# Altium schematic sheet SW6208 Demo board.SchDoc
size A2; SheetNumber: 0; SheetTotal: 0
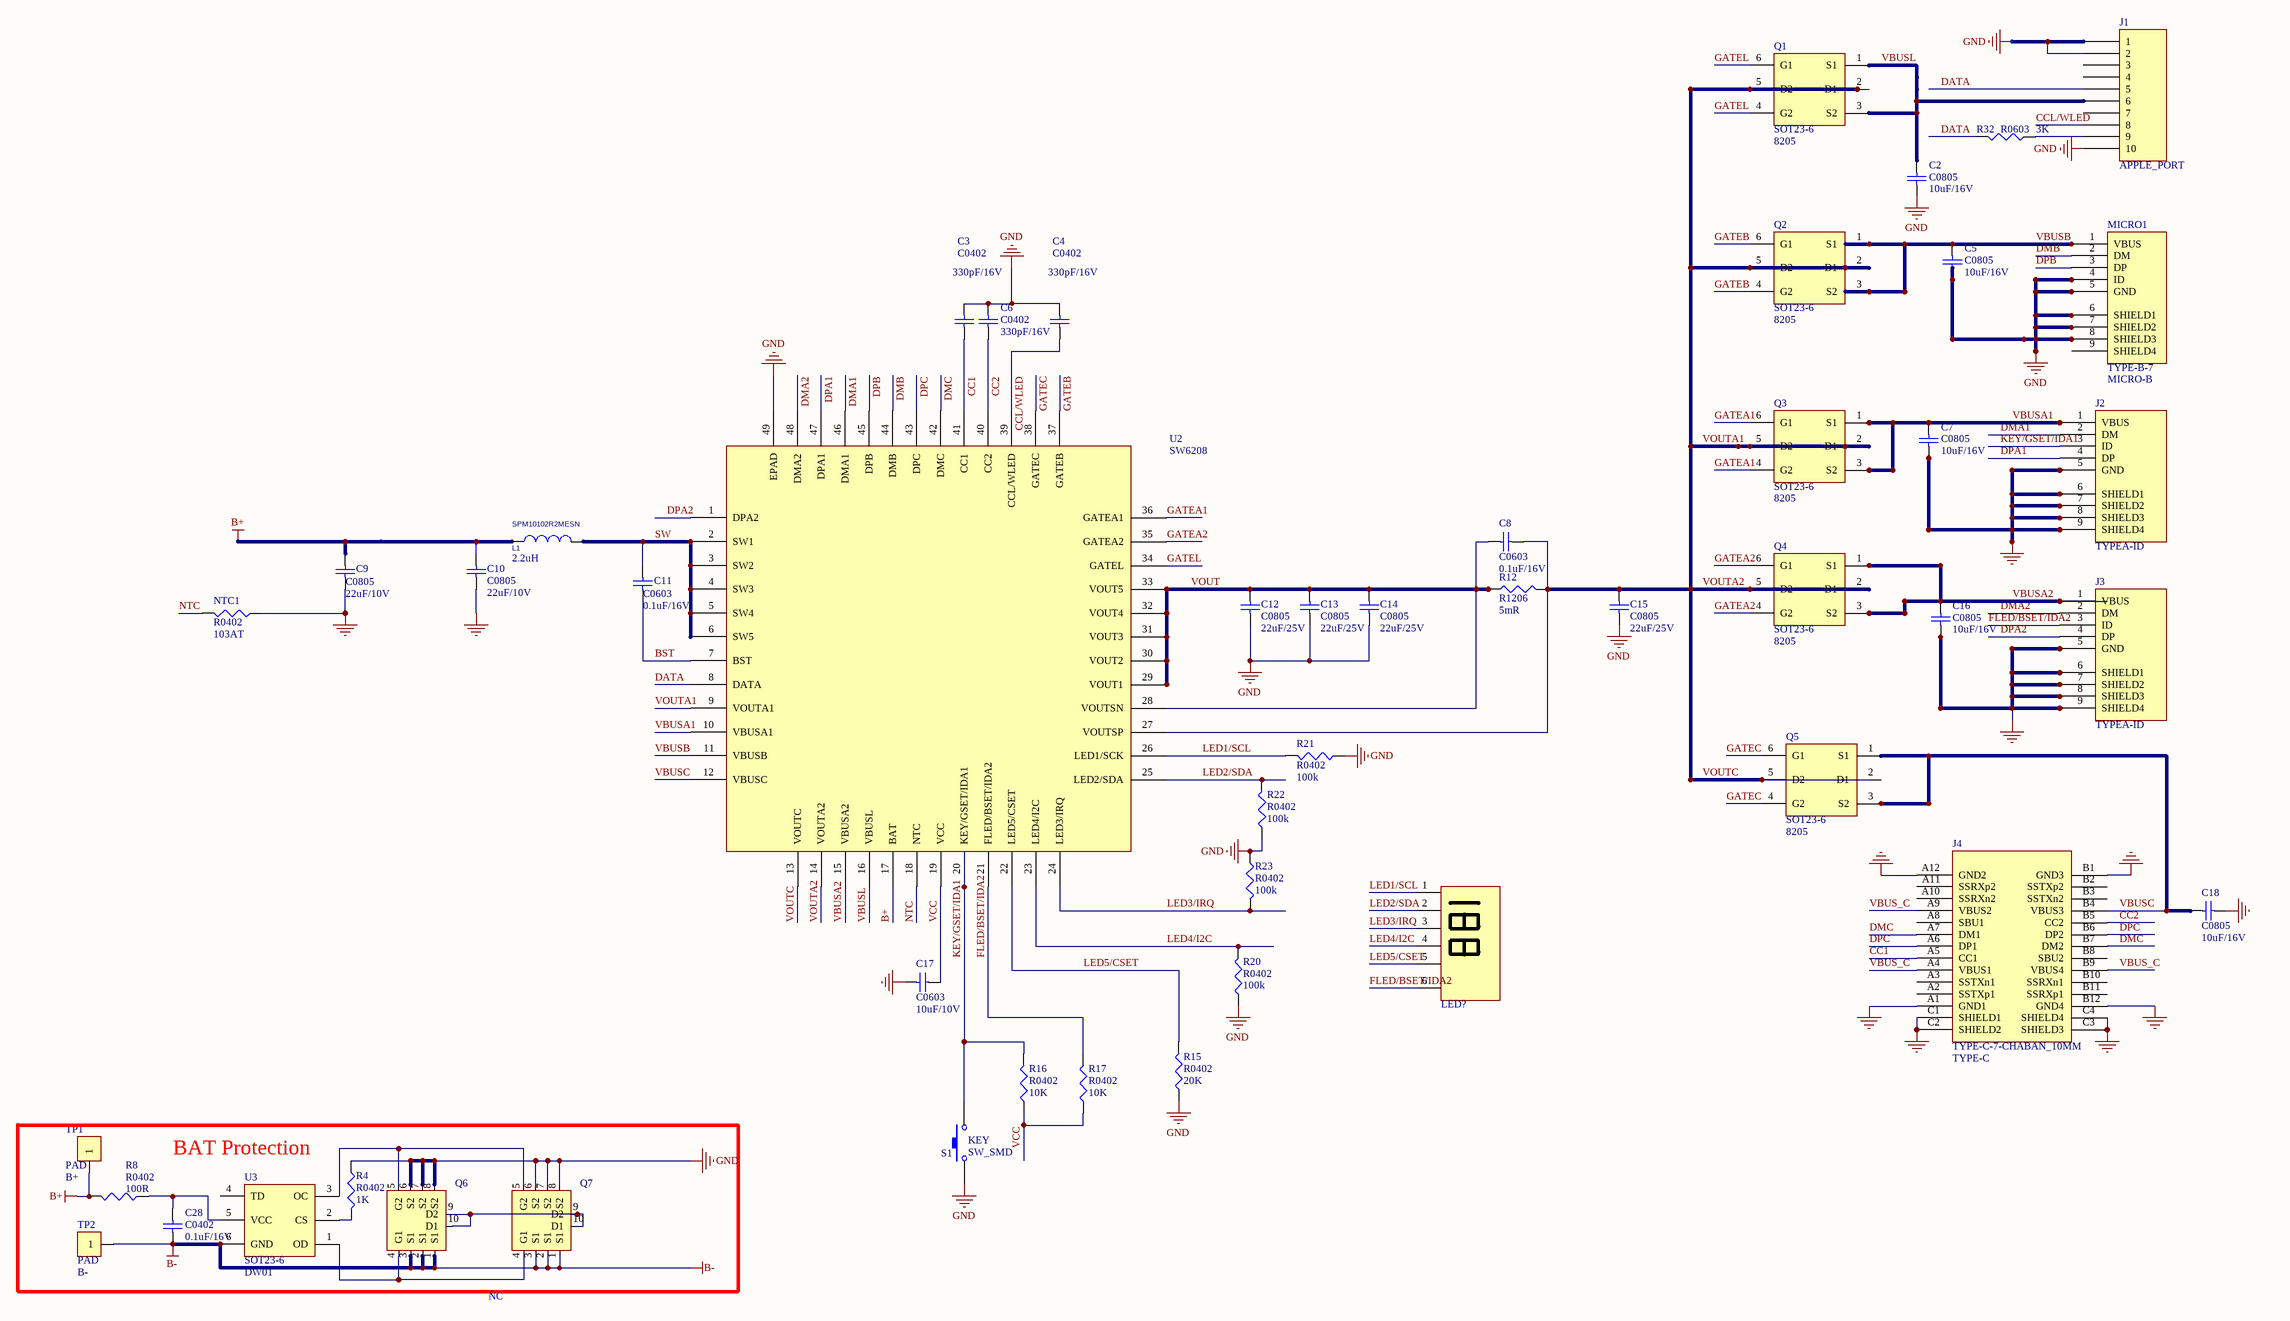
[diagram p0: SW6208 Demo board.SchDoc]

## Parts
C2  C0805  value 10uF/16V  [C0805]
C3  C0402  value 330pF/16V  [c0603]
C4  C0402  value 330pF/16V  [c0603]
C5  C0805  value 10uF/16V  [C0805]
C6  C0402  value 330pF/16V  [c0603]
C7  C0805  value 10uF/16V  [C0805]
C8  C0603  value 0.1uF/16V  [C0603]
C9  C0805  value 22uF/10V  [C0805]
C10  C0805  value 22uF/10V  [C0805]
C11  C0603  value 0.1uF/16V  [C0603]
C12  C0805  value 22uF/25V  [C0805]
C13  C0805  value 22uF/25V  [C0805]
C14  C0805  value 22uF/25V  [C0805]
C15  C0805  value 22uF/25V  [C0805]
C16  C0805  value 10uF/16V  [C0805]
C17  C0603  value 10uF/10V  [c0603]
C18  C0805  value 10uF/16V  [C0805]
C28  C0402  value 0.1uF/16V  [0402C]
J1  APPLE_PORT  [Lightning]
J2  TYPEA-ID  [USB-OPPO-1]
J3  TYPEA-ID  [USB-OPPO-1]
J4  Footprint: TYPE-C-7-CHABAN_10MM  [TYPEC-1]  (hidden comment: TYPE-C)
L1  SPM10102R2MESN  value 2.2uH  [L7*7]
LED?  LED_6  [6-数码管居下]  (value not drawn)
MICRO1  value MICRO-B  Footprintf: TYPE-B-7  [MICRO常规]  (hidden comment: USB_MICRO_B)
NTC1  R0402  value 103AT  [R0402]
Q1  Footprinf: SOT23-6  [SOT-23-6]  (hidden comment: 8205)
Q2  Footprinf: SOT23-6  [SOT-23-6]  (hidden comment: 8205)
Q3  Footprinf: SOT23-6  [SOT-23-6]  (hidden comment: 8205)
Q4  Footprinf: SOT23-6  [SOT-23-6]  (hidden comment: 8205)
Q5  Footprinf: SOT23-6  [SOT-23-6]  (hidden comment: 8205)
Q6  (no value)  [DFN3*3-EPAD - duplicate]
Q7  NC  [DFN3*3-EPAD - duplicate]
R4  R0402  value 1K  [R0402]
R8  R0402  value 100R  [R0402]
R12  R1206  value 5mR  [R1206]
R15  R0402  value 20K  [R0402]
R16  R0402  value 10K  [R0402]
R17  R0402  value 10K  [R0402]
R20  R0402  value 100k  [R0402]
R21  R0402  value 100k  [R0402]
R22  R0402  value 100k  [R0402]
R23  R0402  value 100k  [R0402]
R32  R0603  value 3K  [R0603]
S1  Footprinf: SW_SMD  (hidden comment: KEY)
TP1  Footprint: PAD  [TIP_4*6]  (hidden comment: B+)
TP2  Footprint: PAD  [TIP_4*6]  (hidden comment: B-)
U2  value SW6208  [QFN48-6206-6*6]  (hidden comment: SW6206)
U3  Footprinf: SOT23-6  [SOT-23-6]  (hidden comment: DW01)

## Nets
B+: C9.2 C10.2 L1.1 R8.2 TP1.1 U2.17(BAT)
B-: C28.1 Q6.1(S1) Q6.2(S1) Q6.3(S1) Q7.1(S1) Q7.2(S1) Q7.3(S1) TP2.1 U3.6(GND)
GND: C2.1 C3.2 C4.2 C5.1 C6.2 C7.1 C9.1 C10.1 C12.1 C13.1 C14.1 C15.1 C16.1 C17.2 C18.1 J1.1 J1.2 J1.10 J2.5(GND) J2.6(SHIELD1) J2.7(SHIELD2) J2.8(SHIELD3) J2.9(SHIELD4) J3.5(GND) J3.6(SHIELD1) J3.7(SHIELD2) J3.8(SHIELD3) J3.9(SHIELD4) J4.A1(GND1) J4.A12(GND2) J4.B1(GND3) J4.B12(GND4) J4.C1(SHIELD1) J4.C2(SHIELD2) J4.C3(SHIELD3) J4.C4(SHIELD4) MICRO1.4(ID) MICRO1.5(GND) MICRO1.6(SHIELD1) MICRO1.7(SHIELD2) MICRO1.8(SHIELD3) NTC1.1 Q6.6(S2) Q6.7(S2) Q6.8(S2) Q7.6(S2) Q7.7(S2) Q7.8(S2) R4.1 R15.1 R20.1 R21.1 R22.1 R23.1 S1.1 U2.49(EPAD)
BST: C11.1 U2.7(BST)
CC1: C3.1 J4.A5(CC1) U2.41(CC1)
CC2: C6.1 J4.B5(CC2) U2.40(CC2)
CCL/WLED: C4.1 J1.8 U2.39(CCL/WLED)
DATA: J1.5 R32.2 U2.8(DATA)
DMA1: J2.2(DM) U2.46(DMA1)
DMA2: J3.2(DM) U2.48(DMA2)
DMB: MICRO1.2(DM) U2.44(DMB)
DMC: J4.A7(DM1) J4.B7(DM2) U2.42(DMC)
DPA1: J2.4(DP) U2.47(DPA1)
DPA2: J3.4(DP) U2.1(DPA2)
DPB: MICRO1.3(DP) U2.45(DPB)
DPC: J4.A6(DP1) J4.B6(DP2) U2.43(DPC)
FLED/BSET/IDA2: J3.3(ID) LED?.6(G) R17.2 U2.21(FLED/BSET/IDA2)
GATEA1: Q3.4(G2) Q3.6(G1) U2.36(GATEA1)
GATEA2: Q4.4(G2) Q4.6(G1) U2.35(GATEA2)
GATEB: Q2.4(G2) Q2.6(G1) U2.37(GATEB)
GATEC: Q5.4(G2) Q5.6(G1) U2.38(GATEC)
GATEL: Q1.4(G2) Q1.6(G1) U2.34(GATEL)
KEY/GSET/IDA1: J2.3(ID) R16.2 S1.2 U2.20(KEY/GSET/IDA1)
LED1/SCL: LED?.1(F) R21.2 U2.26(LED1/SCK)
LED2/SDA: LED?.2(C) R22.2 U2.25(LED2/SDA)
LED3/IRQ: LED?.3(D) R23.2 U2.24(LED3/IRQ)
LED4/I2C: LED?.4(E) R20.2 U2.23(LED4/I2C)
LED5/CSET: LED?.5(G) R15.2 U2.22(LED5/CSET)
NTC: NTC1.2 U2.18(NTC)
SW: C11.2 L1.2 U2.2(SW1) U2.3(SW2) U2.4(SW3) U2.5(SW4) U2.6(SW5)
VBUS_C: J4.A4(VBUS1) J4.A9(VBUS2) J4.B9(VBUS4)
VBUSA1: C7.2 J2.1(VBUS) Q3.1(S1) Q3.3(S2) U2.10(VBUSA1)
VBUSA2: C16.2 J3.1(VBUS) Q4.1(S1) Q4.3(S2) U2.15(VBUSA2)
VBUSB: C5.2 MICRO1.1(VBUS) Q2.1(S1) Q2.3(S2) U2.11(VBUSB)
VBUSC: C18.2 J4.B4(VBUS3) Q5.1(S1) Q5.3(S2) U2.12(VBUSC)
VBUSL: C2.2 J1.6 Q1.1(S1) Q1.3(S2) U2.16(VBUSL)
VCC: C17.1 R16.1 R17.1 U2.19(VCC)
VOUT: C8.1 C12.2 C13.2 C14.2 R12.1 U2.28(VOUTSN) U2.29(VOUT1) U2.30(VOUT2) U2.31(VOUT3) U2.32(VOUT4) U2.33(VOUT5)
VOUTA1: C8.2 C15.2 Q1.2(D1) Q1.5(D2) Q2.2(D1) Q2.5(D2) Q3.2(D1) Q3.5(D2) Q4.2(D1) Q4.5(D2) Q5.5(D2) R12.2 U2.9(VOUTA1) U2.13(VOUTC) U2.14(VOUTA2) U2.27(VOUTSP)  [also labelled VOUTA2, VOUTC]
NetC28_2: C28.2 R8.1 U3.5(VCC)
NetJ1_9: J1.9 R32.1
NetQ6_4: Q6.4(G1) Q7.4(G1) U3.1(OD)
NetQ6_5: Q6.5(G2) Q7.5(G2) U3.3(OC)
NetQ6_9: Q6.9(D2) Q6.10(D1) Q7.9(D2) Q7.10(D1)
NetR4_2: R4.2 U3.2(CS)

Not connected (* = marked no-connect by the designer): J1 3 4 7; J4 A2(SSTXp1) A3(SSTXn1) A8(SBU1) A10(SSRXn2) A11(SSRXp2) B2(SSTXp2) B3(SSTXn2) B8(SBU2) B10(SSRXn1) B11(SSRXp1); MICRO1 9(SHIELD4); Q5 2(D1); U3 4(TD)

## Notes on the sheet
- BAT Protection
- Title
- Size:
- Date:
- File:
- A2
- Number:
- Time:
- Revision:
- Sheet
- of

## Library data of the parts
C2-C8 C11 C16-C18 = CAP0603: Capacitor; Published: 8-Jun-2000; LatestRevisionDate: 17-Jul-2002; LatestRevisionNote: Re-released for DXP Platform.; PackageReference: RAD-0.3; Publisher: Altium Limited; PackageDescription: Radial Cap, Thru-Hole; 2 Leads; 0.3 in Pin Spacing
C9 C10 C12-C15 = CAP0805: Capacitor; Published: 8-Jun-2000; LatestRevisionDate: 17-Jul-2002; LatestRevisionNote: Re-released for DXP Platform.; PackageReference: RAD-0.3; Publisher: Altium Limited; PackageDescription: Radial Cap, Thru-Hole; 2 Leads; 0.3 in Pin Spacing
C28 = Cap: Capacitor; Published: 8-Jun-2000; LatestRevisionDate: 17-Jul-2002; LatestRevisionNote: Re-released for DXP Platform.; PackageReference: RAD-0.3; Publisher: Altium Limited; PackageDescription: Radial Cap, Thru-Hole; 2 Leads; 0.3 in Pin Spacing
L1 = INDUCTOR
NTC1 R12 R15-R17 R20-R23 R32 = RES: Resistor; Published: 8-Jun-2000; LatestRevisionDate: 29-May-2009; LatestRevisionNote: IPC-7351 Footprint Added.; PackageReference: J1-0603; Publisher: Altium Limited; PackageDescription: Chip Resistor
Q1-Q5 = 8205B: Value: 8205
Q6 Q7 = DFN-8
R4 R8 = Res3: Resistor; Published: 8-Jun-2000; LatestRevisionDate: 29-May-2009; LatestRevisionNote: IPC-7351 Footprint Added.; PackageReference: J1-0603; Publisher: Altium Limited; PackageDescription: Chip Resistor
S1 = SW K: Value: KEY
TP1 TP2 = Test Point
  TP1: Value: B+
  TP2: Value: B-
J1 = APPLE_PORT: Footprint: *; Value: APPLE_PORT
J4 = TYPE-C: Value: TYPE-C
U2 = SW6206: Footprint: QFN48_EPAD_SW6206_6X6
U3 = DW01: Value: DW01